# EAGLE design ppg_array_wireless (EAGLE 9.1.1)
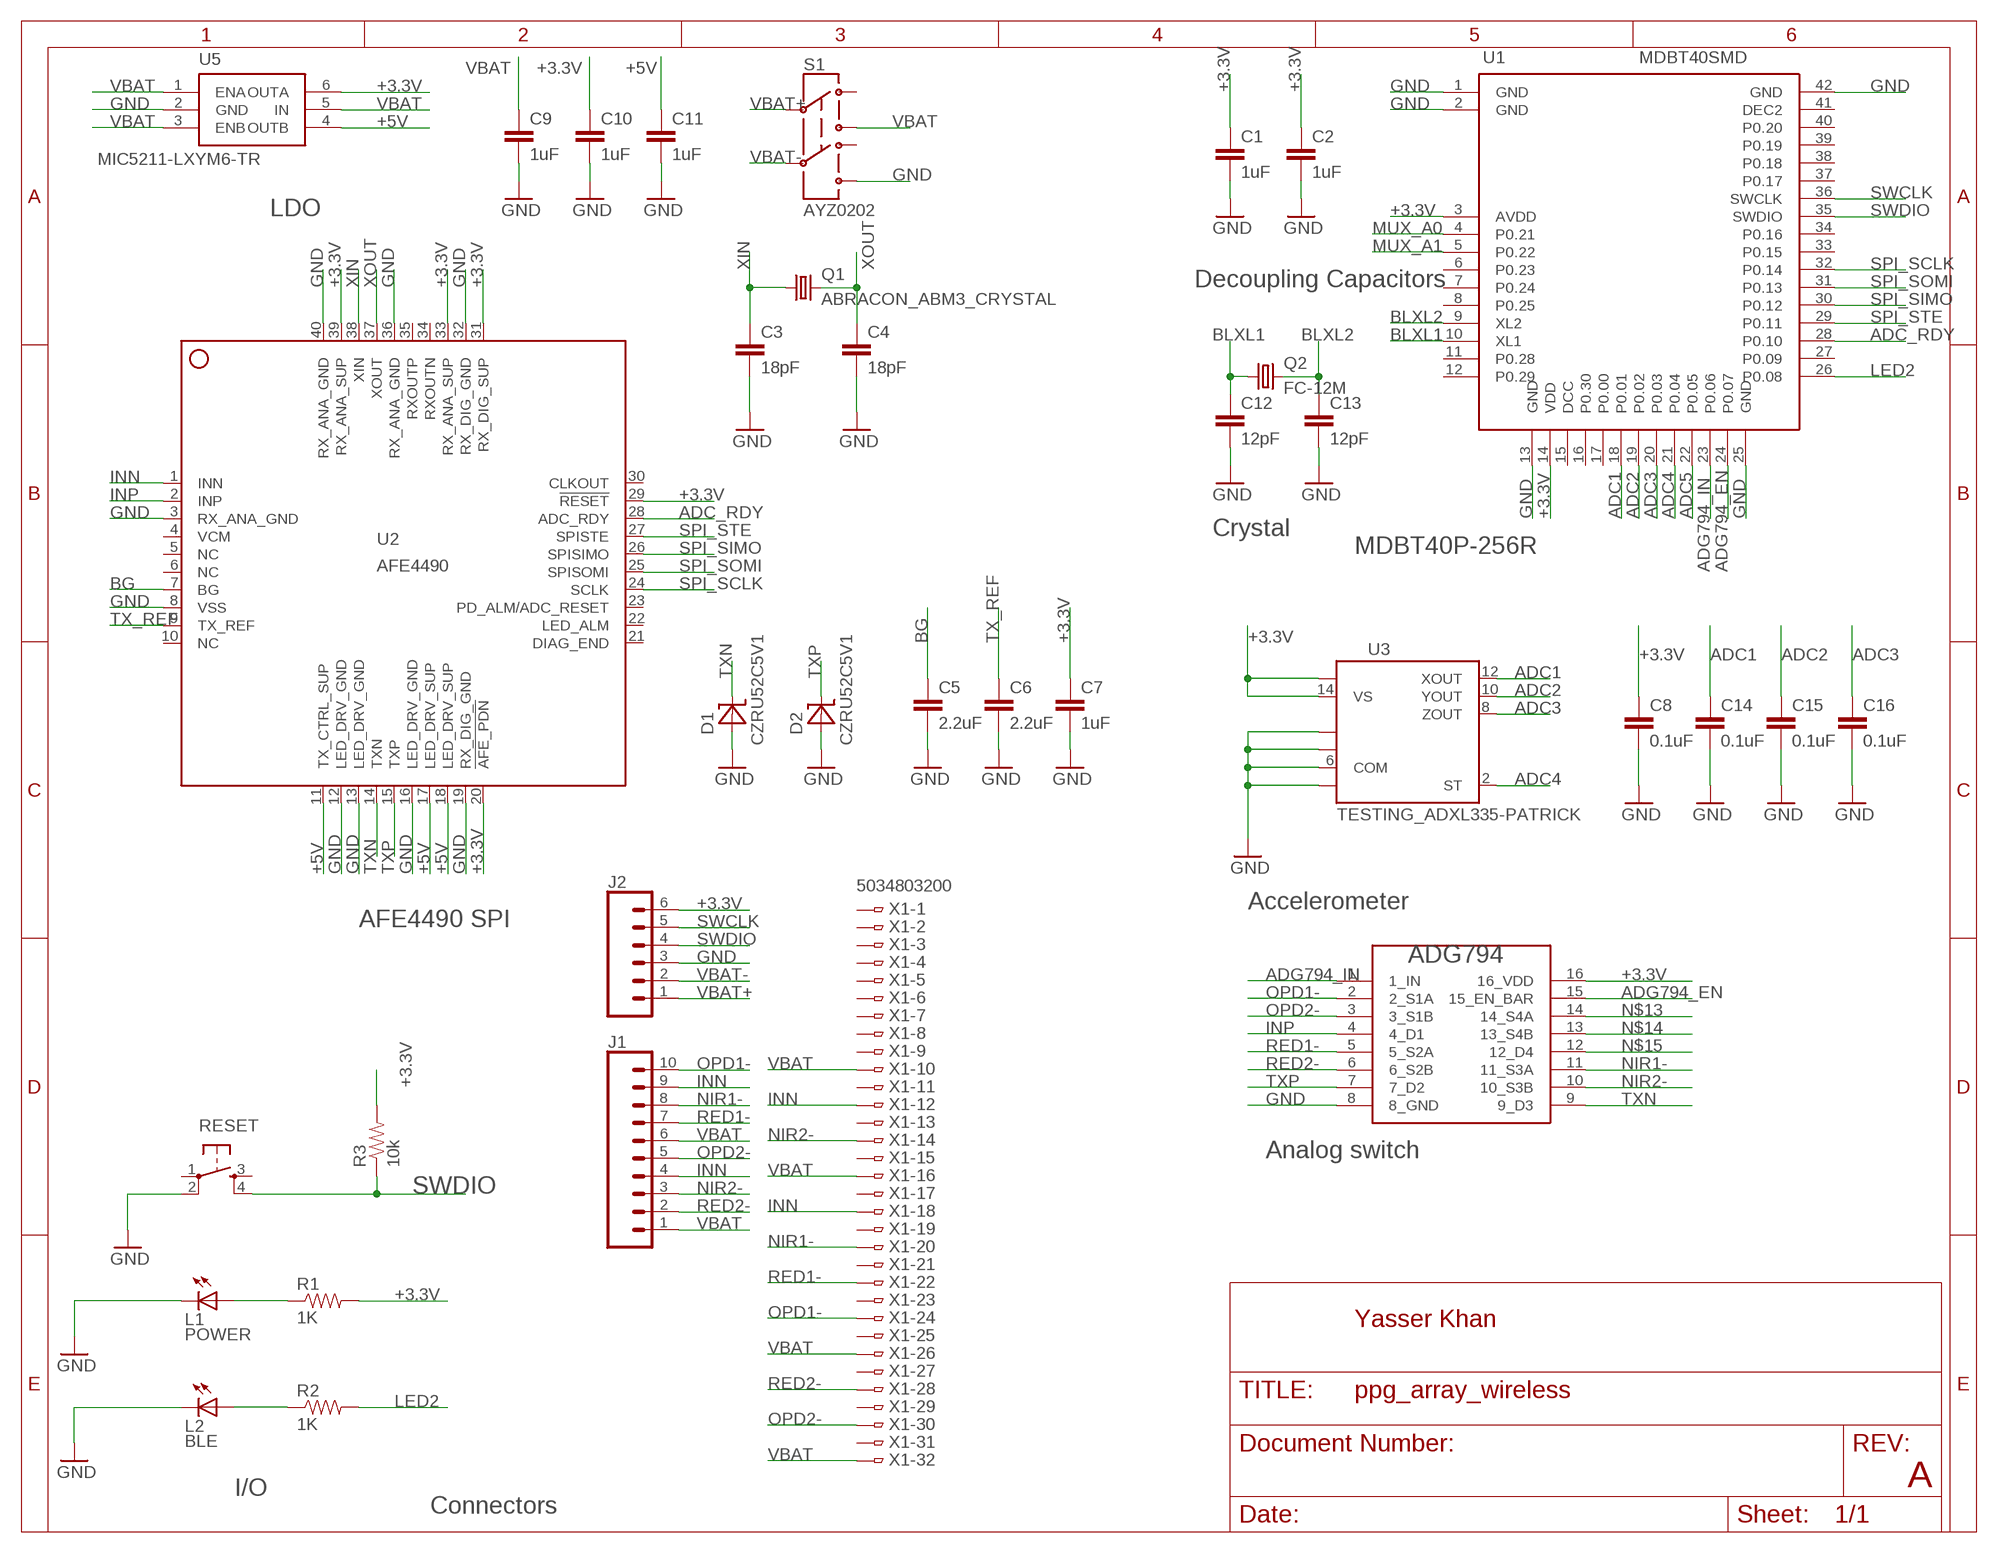
[diagram p0: schematic, sheet 1]

## Parts
C1  1uF  CAP0603-CAP  [0603-CAP]
C2  1uF  CAP0603-CAP  [0603-CAP]
C3  18pF  CAP0603-CAP  [0603-CAP]
C4  18pF  CAP0603-CAP  [0603-CAP]
C5  2.2uF  CAP0603-CAP  [0603-CAP]
C6  2.2uF  CAP0603-CAP  [0603-CAP]
C7  1uF  CAP0603-CAP  [0603-CAP]
C8  0.1uF  CAP0603-CAP  [0603-CAP]
C9  1uF  CAP0603-CAP  [0603-CAP]
C10  1uF  CAP0603-CAP  [0603-CAP]
C11  1uF  CAP0603-CAP  [0603-CAP]
C12  12pF  CAP0603-CAP  [0603-CAP]
C13  12pF  CAP0603-CAP  [0603-CAP]
C14  0.1uF  CAP0603-CAP  [0603-CAP]
C15  0.1uF  CAP0603-CAP  [0603-CAP]
C16  0.1uF  CAP0603-CAP  [0603-CAP]
D1  CZRU52C5V1  [CZRU52C5V1]
D2  CZRU52C5V1  [CZRU52C5V1]
J1  CONN_10"  [1X10]
J2  CONN_06SILK_FEMALE_PTH  [1X06]
L1  POWER  LEDCHIP-LED0603  [CHIP-LED0603]
L2  BLE  LEDCHIP-LED0603  [CHIP-LED0603]
Q1  ABRACON_ABM3_CRYSTAL  [ABRACON_ABM3_CRYSTAL]
Q2  FC-12M  [FC-12M]
R1  1K  RESISTOR0603-RES  [0603-RES]
R2  1K  RESISTOR0603-RES  [0603-RES]
R3  10k  RESISTOR0603-RES  [0603-RES]
RESET  TAC_SWITCHSMD  [TACTILE_SWITCH_SMD]
S1  AYZ0202  [AYZ0202]
U1  MDBT40SMD  [MDBT40]
U2  AFE4490  [QFN40-6X6]
U3  TESTING_ADXL335-PATRICK  [TESTING_LFCSP-16]
U4  ADG794  [QSOP16]
U5  MIC5211-LXYM6-TR  [SOT-23-6]
X1  5034803200  [5034803200]

## Nets
+3.3V: C1.1 C2.1 C7.1 C8.1 C10.1 J2.6 R1.2 R3.2 U1.3(AVDD) U1.14(VDD) U2.20(!AFE_PDN) U2.29(!RESET) U2.31(RX_DIG_SUP) U2.33(RX_ANA_SUP) U2.39(RX_ANA_SUP) U3.14(VS) U3.15(VS) U4.16(16_VDD) U5.6(OUTA)
+5V: C11.1 U2.11(TX_CTRL_SUP) U2.17(LED_DRV_SUP) U2.18(LED_DRV_SUP) U5.4(OUTB)
ADC1: C14.1 U1.18(P0.01) U3.12(XOUT)
ADC2: C15.1 U1.19(P0.02) U3.10(YOUT)
ADC3: C16.1 U1.20(P0.03) U3.8(ZOUT)
ADC4: U1.21(P0.04) U3.2(ST)
ADC5: U1.22(P0.05)
ADC_RDY: U1.28(P0.10) U2.28(ADC_RDY)
ADG794_EN: U1.24(P0.07) U4.15(15_EN_BAR)
ADG794_IN: U1.23(P0.06) U4.1(1_IN)
BG: C5.1 U2.7(BG)
BLXL1: C12.1 Q2.1 U1.10(XL1)
BLXL2: C13.1 Q2.2 U1.9(XL2)
GND: C1.2 C2.2 C3.2 C4.2 C5.2 C6.2 C7.2 C8.2 C9.2 C10.2 C11.2 C12.2 C13.2 C14.2 C15.2 C16.2 D1.A D2.A J2.3 L1.C L2.C RESET.2 S1.4 U1.1(GND) U1.2(GND) U1.13(GND) U1.25(GND) U1.42(GND) U2.3(RX_ANA_GND) U2.8(VSS) U2.12(LED_DRV_GND) U2.13(LED_DRV_GND) U2.16(LED_DRV_GND) U2.19(RX_DIG_GND) U2.32(RX_DIG_GND) U2.36(RX_ANA_GND) U2.40(RX_ANA_GND) U3.3(COM) U3.5(COM) U3.6(COM) U3.7(COM) U4.8(8_GND) U5.2(GND)
INN: J1.4 J1.9 U2.1(INN) X1.12 X1.18
INP: U2.2(INP) U4.4(4_D1)
LED2: R2.2 U1.26(P0.08)
MUX_A0: U1.4(P0.21)
MUX_A1: U1.5(P0.22)
N$1: L1.A R1.1
N$4: L2.A R2.1
N$13: U4.14(14_S4A)
N$14: U4.13(13_S4B)
N$15: U4.12(12_D4)
NIR1-: J1.8 U4.11(11_S3A) X1.20
NIR2-: J1.3 U4.10(10_S3B) X1.14
OPD1-: J1.10 U4.2(2_S1A) X1.24
OPD2-: J1.5 U4.3(3_S1B) X1.30
RED1-: J1.7 U4.5(5_S2A) X1.22
RED2-: J1.2 U4.6(6_S2B) X1.28
SPI_SCLK: U1.32(P0.14) U2.24(SCLK)
SPI_SIMO: U1.30(P0.12) U2.26(SPISIMO)
SPI_SOMI: U1.31(P0.13) U2.25(SPISOMI)
SPI_STE: U1.29(P0.11) U2.27(SPISTE)
SWCLK: J2.5 U1.36(SWCLK)
SWDIO: J2.4 R3.1 RESET.4 U1.35(SWDIO)
TX_REF: C6.1 U2.9(TX_REF)
TXN: D1.C U2.14(TXN) U4.9(9_D3)
TXP: D2.C U2.15(TXP) U4.7(7_D2)
VBAT: C9.1 J1.1 J1.6 S1.1 U5.1(ENA) U5.3(ENB) U5.5(IN) X1.10 X1.16 X1.26 X1.32
VBAT+: J2.1 S1.2
VBAT-: J2.2 S1.5
XIN: C3.1 Q1.P$1 U2.38(XIN)
XOUT: C4.1 Q1.P$2 U2.37(XOUT)
Unconnected: RESET.1 RESET.3 S1.3 S1.6 U1.6(P0.23) U1.7(P0.24) U1.8(P0.25) U1.11(P0.28) U1.12(P0.29) U1.15(DCC) U1.16(P0.30) U1.17(P0.00) U1.27(P0.09) U1.33(P0.15) U1.34(P0.16) U1.37(P0.17) U1.38(P0.18) U1.39(P0.19) U1.40(P0.20) U1.41(DEC2) U2.4(VCM) U2.5(NC) U2.6(NC) U2.10(NC) U2.21(DIAG_END) U2.22(LED_ALM) U2.23(PD_ALM/ADC_RESET) U2.30(CLKOUT) U2.34(RXOUTN) U2.35(RXOUTP) X1.1 X1.2 X1.3 X1.4 X1.5 X1.6 X1.7 X1.8 X1.9 X1.11 X1.13 X1.15 X1.17 X1.19 X1.21 X1.23 X1.25 X1.27 X1.29 X1.31

## Notes on the sheet
- LDO
- Decoupling Capacitors
- Crystal
- MDBT40P-256R
- Accelerometer
- AFE4490 SPI
- Analog switch
- Yasser Khan
- A
- I/O
- Connectors

## Power pins joined to a net without a drawn wire
GND: U2.EXP@1(GND) U2.EXP@2(GND) U2.EXP@3(GND) U2.EXP@4(GND) U2.EXP@5(GND) U2.EXP@6(GND) U2.EXP@7(GND) U2.EXP@8(GND) U2.EXP@9(GND) U2.EXP@10(GND) U2.EXP@11(GND) U2.EXP@12(GND) U2.EXP@13(GND) U2.EXP@14(GND) U2.EXP@15(GND) U2.EXP@16(GND) U2.PWR@1(GND) U2.PWR@2(GND)

## Library data of the parts
C1-C16 = SparkFun-Capacitors:CAP: Capacitor Standard 0603 ceramic capacitor, and 0.1" leaded capacitor.
D1 D2 = diode:CZRU52C5V1
J1 = SparkFun-Connectors:CONN_10: Multi connection point. Often used as Generic Header-pin footprint for 0.1 inch spaced/style header connections On any of the 0.1 inch spaced packages, you can populate with these: Break Away Headers - Straight <https://www.sparkfun.com/products/116> (PRT-00116) Break Away Male Headers - Right Angle <https://www.sparkfun.com/products/553> (PRT-00553) Female Headers <https://www.sparkfun.com/products/115> (PRT-00115) Break Away Headers - Machine Pin <https://www.sparkfun.com/products/117> (PRT-00117) Break Away Female Headers - Swiss Machine Pin <https://www.sparkfun.com/products/743> (PRT-00743) Arduino Stackable Header - 10 Pin <https://www.sparkfun.com/products/11376> (PRT-11376) For SCREWTERMINALS and SPRING TERMINALS visit here: Screw Terimnals on SparkFun.com <https://www.sparkfun.com/search/results?term=Screw+Terminals> (5mm/3.5mm/2.54mm spacing) This device is also useful as a general connection point to wire up your design to another part of your project. Our various solder wires solder well into these plated through hole pads. Hook-Up Wire - Assortment (Stranded, 22 AWG) <https://www.sparkfun.com/products/11375> (PRT-11375) Hook-Up Wire - Assortment (Solid Core, 22 AWG) <https://www.sparkfun.com/products/11367> (PRT-11367) View the entire wire category on our website here <https://www.sparkfun.com/categories/141> Special notes: Molex polarized connector foot print use with SKU : PRT-08231 with associated crimp pins and housings. 1MM SMD Version SKU: PRT-10208 NOTES ON THE VARIANTS LOCK and LOCK_LONGPADS... This footprint was designed to help hold the alignment of a through-hole component (i.e. 6-pin header) while soldering it into place. You may notice that each hole has been shifted either up or down by 0.005 of an inch from it's more standard position (which is a perfectly straight line). This slight alteration caused the pins (the squares in the middle) to touch the edges of the holes. Because they are alternating, it causes a "brace" to hold the component in place. 0.005 has proven to be the perfect amount of "off-center" position when using our standard breakaway headers. Although looks a little odd when you look at the bare footprint, once you have a header in there, the alteration is very hard to notice. Also,if you push a header all the way into place, it is covered up entirely on the bottom side.; PROD_ID: CONN-11563
J2 = SparkFun-Connectors:CONN_06: Multi connection point. Often used as Generic Header-pin footprint for 0.1 inch spaced/style header connections On any of the 0.1 inch spaced packages, you can populate with these: Break Away Headers - Straight <https://www.sparkfun.com/products/116> (PRT-00116) Break Away Male Headers - Right Angle <https://www.sparkfun.com/products/553> (PRT-00553) Female Headers <https://www.sparkfun.com/products/115> (PRT-00115) Break Away Headers - Machine Pin <https://www.sparkfun.com/products/117> (PRT-00117) Break Away Female Headers - Swiss Machine Pin <https://www.sparkfun.com/products/743> (PRT-00743) Arduino Stackable Header - 6 Pin <https://www.sparkfun.com/products/9280> (PRT-09280) For SCREWTERMINALS and SPRING TERMINALS visit here: Screw Terimnals on SparkFun.com <https://www.sparkfun.com/search/results?term=Screw+Terminals> (5mm/3.5mm/2.54mm spacing) This device is also useful as a general connection point to wire up your design to another part of your project. Our various solder wires solder well into these plated through hole pads. Hook-Up Wire - Assortment (Stranded, 22 AWG) <https://www.sparkfun.com/products/11375> (PRT-11375) Hook-Up Wire - Assortment (Solid Core, 22 AWG) <https://www.sparkfun.com/products/11367> (PRT-11367) View the entire wire category on our website here <https://www.sparkfun.com/categories/141>; PROD_ID: CONN-08437
L1 L2 = led:LED: LED OSRAM: - CHIPLED LG R971, LG N971, LY N971, LG Q971, LY Q971, LO R971, LY R971 LH N974, LH R974 LS Q976, LO Q976, LY Q976 LO Q996 - Hyper CHIPLED LW Q18S LB Q993, LB Q99A, LB R99A - SideLED LS A670, LO A670, LY A670, LG A670, LP A670 LB A673, LV A673, LT A673, LW A673 LH A674 LY A675 LS A676, LA A676, LO A676, LY A676, LW A676 LS A679, LY A679, LG A679 - Hyper Micro SIDELED® LS Y876, LA Y876, LO Y876, LY Y876 LT Y87S - SmartLED LW L88C, LW L88S LB L89C, LB L89S, LG L890 LS L89K, LO L89K, LY L89K LS L896, LA L896, LO L896, LY L896 - TOPLED LS T670, LO T670, LY T670, LG T670, LP T670 LSG T670, LSP T670, LSY T670, LOP T670, LYG T670 LG T671, LOG T671, LSG T671 LB T673, LV T673, LT T673, LW T673 LH T674 LS T676, LA T676, LO T676, LY T676, LB T676, LH T676, LSB T676, LW T676 LB T67C, LV T67C, LT T67C, LS T67K, LO T67K, LY T67K, LW E67C LS E67B, LA E67B, LO E67B, LY E67B, LB E67C, LV E67C, LT E67C LW T67C LS T679, LY T679, LG T679 LS T770, LO T770, LY T770, LG T770, LP T770 LB T773, LV T773, LT T773, LW T773 LH T774 LS E675, LA E675, LY E675, LS T675 LS T776, LA T776, LO T776, LY T776, LB T776 LHGB T686 LT T68C, LB T68C - Hyper Mini TOPLED® LB M676 - Mini TOPLED Santana® LG M470 LS M47K, LO M47K, LY M47K Source: http://www.osram.convergy.de LUXEON: - LUMILED® LXK2-PW12-R00, LXK2-PW12-S00, LXK2-PW14-U00, LXK2-PW14-V00 LXK2-PM12-R00, LXK2-PM12-S00, LXK2-PM14-U00 LXK2-PE12-Q00, LXK2-PE12-R00, LXK2-PE12-S00, LXK2-PE14-T00, LXK2-PE14-U00 LXK2-PB12-K00, LXK2-PB12-L00, LXK2-PB12-M00, LXK2-PB14-N00, LXK2-PB14-P00, LXK2-PB14-Q00 LXK2-PR12-L00, LXK2-PR12-M00, LXK2-PR14-Q00, LXK2-PR14-R00 LXK2-PD12-Q00, LXK2-PD12-R00, LXK2-PD12-S00 LXK2-PH12-R00, LXK2-PH12-S00 LXK2-PL12-P00, LXK2-PL12-Q00, LXK2-PL12-R00 Source: www.luxeon.com KINGBRIGHT: KA-3528ASYC Source: www.kingbright.com
Q1 = Ava:ABRACON_ABM3_CRYSTAL
Q2 = crystal:FC-12M: kHz RANGE CRYSTAL UNIT LOW PROFILE SMD Source: Epson Toyocom FC-12M.pdf
R1-R3 = SparkFun-Passives:RESISTOR: Resistor Basic schematic elements and footprints for 0603, 1206, and PTH resistors.
RESET = Spark:TAC_SWITCH: SMD Tactiile Switch
S1 = SparkFun-Electromechanical:AYZ0202: SPDT Slide Switch Simple SMD single-pull double-throw slide switch. Good for less than 350mA power switch, switching UARTs between devices, etc. Spark Fun Electronics SKU : COM-00597; PROD_ID: SWCH-08179
U1 = MDBT40P:MDBT40
U2 = AFE4490:AFE4490
U3 = ADXL335_Breakout:TESTING_ADXL335-PATRICK
U4 = ADG794:ADG794
U5 = smd-footprints:MIC5211-LXYM6-TR
X1 = con-hirose:5034803200: 0.5mm Pitch Connectors For FPC/FFC Source: Data sheet <http://www.hirose.co.jp/cataloge_hp/e58605370.pdf>

## Board
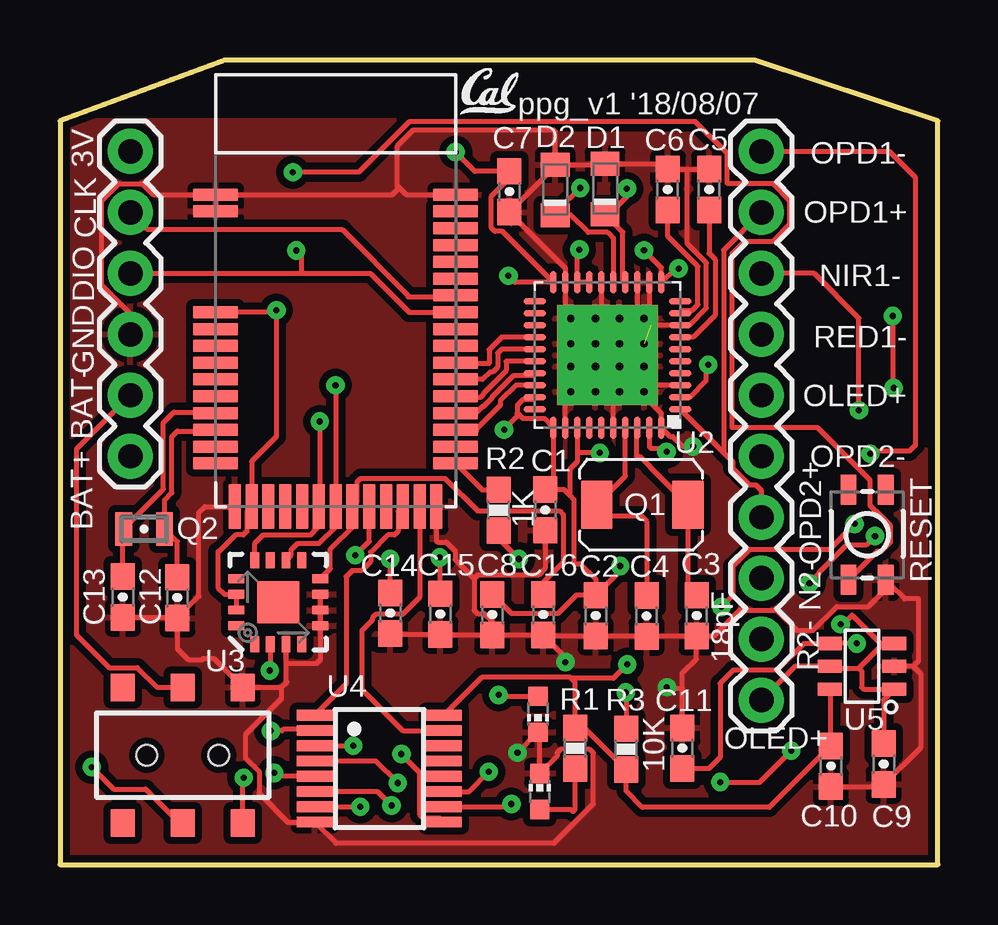
[diagram p1: board, top side]
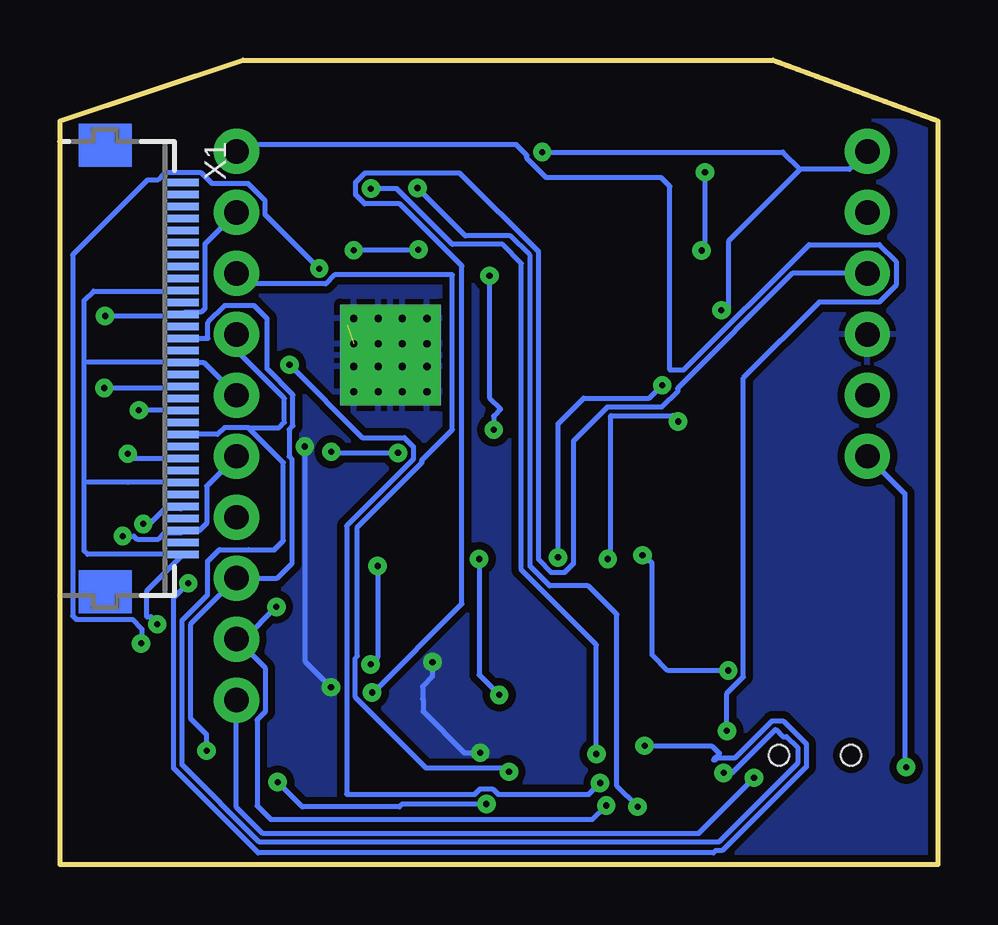
[diagram p2: board, bottom side, seen from below]

Size 36.58 x 33.53 mm. Coordinates in mm from the lower left corner, seen from the top.
Outline: 0,0 36.58,0 36.58,30.99 28.96,33.53 6.86,33.53 0,30.99 0,0
Copper layers (1*16): Top 0.035mm / dielectric 1.5mm / Bottom 0.035mm
Design rules "2016_09_11_SparkFun_bayareacircuits *": minimum track width 8mil, minimum drill 10mil, track to track 6mil, track to pad 6mil, pad to pad 6mil, via to via 6mil, smd to smd 6mil, copper to edge 10mil, drill to drill 8mil, minimum pad ring 12mil, minimum via ring 10mil, stop-mask expansion 4mil, vias tented up to drill 25mil, thermal gap 10mil

### Footprints (pad centres in the part's own frame; a part is rotated, then mirrored left to right if it is on the bottom)
0603-CAP = smd 1.1 x 1: 1 -0.85,0; 2 0.85,0
CZRU52C5V1 = smd 1 x 1.2: A 1.05,0; C -1.05,0
1X10 = drill 1.016 pad 1.88: 1 0,0; 2 2.54,0; 3 5.08,0; 4 7.62,0; 5 10.16,0; 6 12.7,0; 7 15.24,0; 8 17.78,0; 9 20.32,0; 10 22.86,0
1X06 = drill 1.016 pad 1.88: 1 0,0; 2 2.54,0; 3 5.08,0; 4 7.62,0; 5 10.16,0; 6 12.7,0
CHIP-LED0603 = smd 0.8 x 0.8: A 0,-0.75; C 0,0.75
ABRACON_ABM3_CRYSTAL = smd 1.3 x 2: P$1 -3.4,0.1; P$2 0.4,0.1
FC-12M = smd 0.7 x 1.4: 1 -0.85,0; 2 0.85,0
0603-RES = smd 1.1 x 1: 1 -0.85,0; 2 0.85,0
TACTILE_SWITCH_SMD = smd 1.25 x 0.65: 1 -1.875,0.775; 2 1.875,0.775; 3 -1.875,-0.775; 4 1.875,-0.775
AYZ0202 = smd 1 x 1.15: 1 -2.5,2.825; 2 0,2.825; 3 2.5,2.825; 4 -2.5,-2.825; 5 0,-2.825; 6 2.5,-2.825 | hole 0.85: 1.5,0; -1.5,0
MDBT40 = smd 1.85 x 0.5: 1 -5,4; 2 -5,3.3; 3 -5,-0.9; 4 -5,-1.6; 5 -5,-2.3; 6 -5,-3; 7 -5,-3.7; 8 -5,-4.4; 9 -5,-5.1; 10 -5,-5.8; 11 -5,-6.5; 12 -5,-7.2; 26 5,-7.2; 27 5,-6.5; 28 5,-5.8; 29 5,-5.1; 30 5,-4.4; 31 5,-3.7; 32 5,-3; 33 5,-2.3; 34 5,-1.6; 35 5,-0.9; 36 5,-0.2; 37 5,0.5; 38 5,1.2; 39 5,1.9; 40 5,2.6; 41 5,3.3; 42 5,4 | smd 0.5 x 1.85: 13 -4.2,-9; 14 -3.5,-9; 15 -2.8,-9; 16 -2.1,-9; 17 -1.4,-9; 18 -0.7,-9; 19 0,-9; 20 0.7,-9; 21 1.4,-9; 22 2.1,-9; 23 2.8,-9; 24 3.5,-9; 25 4.2,-9
QFN40-6X6 = smd 0.95 x 0.28: 1 -3.025,2.25; 2 -3.025,1.75; 3 -3.025,1.25; 4 -3.025,0.75; 5 -3.025,0.25; 6 -3.025,-0.25; 7 -3.025,-0.75; 8 -3.025,-1.25; 9 -3.025,-1.75; 10 -3.025,-2.25; 21 3.025,-2.25; 22 3.025,-1.75; 23 3.025,-1.25; 24 3.025,-0.75; 25 3.025,-0.25; 26 3.025,0.25; 27 3.025,0.75; 28 3.025,1.25; 29 3.025,1.75; 30 3.025,2.25 | smd 0.28 x 0.95: 11 -2.25,-3.025; 12 -1.75,-3.025; 13 -1.25,-3.025; 14 -0.75,-3.025; 15 -0.25,-3.025; 16 0.25,-3.025; 17 0.75,-3.025; 18 1.25,-3.025; 19 1.75,-3.025; 20 2.25,-3.025; 31 2.25,3.025; 32 1.75,3.025; 33 1.25,3.025; 34 0.75,3.025; 35 0.25,3.025; 36 -0.25,3.025; 37 -0.75,3.025; 38 -1.25,3.025; 39 -1.75,3.025; 40 -2.25,3.025 | drill 0.3 pad 1.1 square: EXP@1 -1.525,1.525; EXP@2 -0.5,1.525; EXP@3 0.5,1.525; EXP@4 1.525,1.525; EXP@5 -1.525,0.475; EXP@6 -0.5,0.475; EXP@7 0.5,0.475; EXP@8 1.525,0.475; EXP@9 -1.525,-0.475; EXP@10 -0.5,-0.475; EXP@11 0.5,-0.475; EXP@12 1.525,-0.475; EXP@13 -1.525,-1.525; EXP@14 -0.5,-1.525; EXP@15 0.5,-1.525; EXP@16 1.525,-1.525 | smd 4.191 x 4.191 bottom: PWR@1 0,0 | smd 4.191 x 4.191: PWR@2 0,0
TESTING_LFCSP-16 = smd 1.75 x 1.75: 0 0,0 | smd 0.65 x 0.37: 1 -1.75,0.975; 2 -1.75,0.325; 3 -1.75,-0.325; 4 -1.75,-0.975; 9 1.75,-0.975; 10 1.75,-0.325; 11 1.75,0.325; 12 1.75,0.975 | smd 0.37 x 0.65: 5 -0.975,-1.75; 6 -0.325,-1.75; 7 0.325,-1.75; 8 0.975,-1.75; 13 0.975,1.75; 14 0.325,1.75; 15 -0.325,1.75; 16 -0.975,1.75
QSOP16 = smd 0.45 x 1.5: 1 -2.223,-2.69; 2 -1.587,-2.69; 3 -0.953,-2.69; 4 -0.318,-2.69; 5 0.318,-2.69; 6 0.953,-2.69; 7 1.587,-2.69; 8 2.223,-2.69; 9 2.223,2.69; 10 1.587,2.69; 11 0.953,2.69; 12 0.318,2.69; 13 -0.318,2.69; 14 -0.953,2.69; 15 -1.587,2.69; 16 -2.223,2.69
SOT-23-6 = smd 1 x 0.55: 1 -1.35,0.95; 2 -1.35,0; 3 -1.35,-0.95; 4 1.35,-0.95; 5 1.35,0; 6 1.35,0.95
5034803200 = smd 0.3 x 1.3: 1 -7.75,3.25; 2 -7.25,3.25; 3 -6.75,3.25; 4 -6.25,3.25; 5 -5.75,3.25; 6 -5.25,3.25; 7 -4.75,3.25; 8 -4.25,3.25; 9 -3.75,3.25; 10 -3.25,3.25; 11 -2.75,3.25; 12 -2.25,3.25; 13 -1.75,3.25; 14 -1.25,3.25; 15 -0.75,3.25; 16 -0.25,3.25; 17 0.25,3.25; 18 0.75,3.25; 19 1.25,3.25; 20 1.75,3.25; 21 2.25,3.25; 22 2.75,3.25; 23 3.25,3.25; 24 3.75,3.25; 25 4.25,3.25; 26 4.75,3.25; 27 5.25,3.25; 28 5.75,3.25; 29 6.25,3.25; 30 6.75,3.25; 31 7.25,3.25; 32 7.75,3.25

### Placement (x,y rotation side)
C1  20.22,14.78 270 top
C2  22.32,10.38 270 top
C3  26.52,10.38 270 top
C4  24.44,10.36 270 top
C5  27.05,28.13 90 top
C6  25.33,28.13 90 top
C7  18.73,28.04 270 top
C8  18.01,10.41 270 top
C9  34.32,4.19 270 top
C10  32.12,4.1 270 top
C11  25.93,4.85 90 top
C12  4.89,11.13 270 top
C13  2.62,11.15 270 top
C14  13.77,10.48 270 top
C15  15.85,10.44 270 top
C16  20.14,10.41 270 top
D1  22.71,28.15 90 top
D2  20.64,28.11 90 top
J1  29.22,6.86 90 top
J2  2.93,17.02 90 top
L1  19.99,3.05 0 top
L2  19.91,6.27 180 top
Q1  22.77,15.09 180 top
Q2  3.51,13.99 180 top
R1  21.47,4.85 90 top
R2  18.28,14.77 90 top
R3  23.58,4.81 270 top
RESET  33.63,13.74 270 top
S1  5.12,4.56 180 top
U1  11.49,23.92 0 top
U2  22.81,21.24 180 top
U3  9.09,10.93 90 top
U4  13.31,4 270 top
U5  33.42,8.26 180 top
U$1  [CAL]  16.64,31.23 0 top
X1  34.7,20.68 270 bottom

### Tracks (layer width: path | path; a pad name or v marks a point on that pad's centre or on a via)
+3.3V  (via drill 0.25, 0.25 pad 0.25)
  Top 0.203: 19.06,18.82 19.06,19.15 19.29,19.38 19.68,19.38 U2.29 | 19.06,18.82 19.29,18.59 20.18,18.59 U2.31 20.56,15.94 20.26,15.63 | U1.3 8.93,23.02 v9.02,23.1 9.02,17.83 7.99,16.8 U1.14 7.79,14.72 7.79,13.89 7.64,13.74 7.31,13.74 6.62,13.04 6.58,13.04 6.58,11.54 6.86,11.26 U3.14 U3.15 | C2.1 22.32,11.9 21.68,12.55 21.41,12.55 21.41,15.21 21.23,15.39 | C1.1 20.26,15.63 | 20.26,15.63 20.99,15.63 21.23,15.39 | U2.33 21.56,17.2 | 21.56,17.2 21.56,16.8 21.23,16.47 21.23,15.39 | U5.6 32.12,7.26 C10.1 29.56,2.39 24.27,2.39 23.58,3.07 R3.2 21.85,5.7 R1.2 21.47,7.6 21.3,7.77 | 21.3,7.77 21.27,7.8 17.58,7.8 U4.16 | v16.48,29.69 17.29,28.89 C7.1 18.73,28.6 17.97,27.85 17.97,26.54 18.12,26.39 18.43,26.39 U2.20 18.96,24.26 v18.68,24.54 | C2.1 21.51,11.23 20.75,10.46 20.02,10.46 18.81,10.46 C8.1 | U2.39 24.56,17.41 24.62,17.35 25.13,17.35 v25.27,17.2 | v22.49,17.16 21.6,17.16 21.56,17.2 | v18.5,18.12 19.06,18.68 19.06,18.82 | C2.1 23.34,12.25 v23.34,12.45 | v23.64,8.34 23.06,7.77 21.3,7.77
  Bottom 0.203: J2.6 3.68,28.97 5.73,28.97 | 5.73,28.97 8.73,25.97 8.73,23.04 8.95,23.04 v9.02,23.1 | v16.48,29.69 6.45,29.69 5.73,28.97 | v25.27,17.2 25.23,17.16 v22.49,17.16 | v18.68,24.54 18.68,19.46 18.21,18.99 18.5,18.69 v18.5,18.12 | v23.34,12.45 23.34,8.64 v23.64,8.34
+5V  (via drill 0.25 pad 0.25)
  Top 0.203: v24.33,25.6 25.06,24.88 U2.11 25.64,24.84 v25.78,24.84 | U2.17 U2.18 21.56,25.55 v21.64,25.63 | C11.1 27.04,4 27.51,4.47 27.51,7.56 28.05,8.1 29.87,8.1 30.98,9.21 U5.4 v33.2,9.22
  Bottom 0.203: v21.64,25.63 21.67,25.6 v24.33,25.6 | v25.78,24.84 28.03,27.09 28.03,27.67 28.73,28.37 30.23,28.37 30.69,28.83 32.2,28.83 32.51,28.52 32.93,28.52 36.05,25.41 36.05,10.37 35.9,10.22 33.56,10.22 33.16,9.82 33.16,9.26 v33.2,9.22
ADC1  (via drill 0.25 pad 0.25)
  Top 0.203: U3.12 8.12,13.39 8.47,13.74 10.44,13.74 10.59,13.89 10.59,13.92 10.82,14.15 10.82,14.88 U1.18 10.8,14.93 10.8,15.44 10.82,15.47 v10.82,18.47 | C14.1 13.77,12.72 v13.75,12.74
  Bottom 0.203: v13.75,12.74 13.63,12.87 13.63,18.71 11.06,18.71 v10.82,18.47
ADC2  (via drill 0.25 pad 0.25)
  Top 0.203: U3.10 9.63,12.9 9.63,13.12 9.9,13.38 10.79,13.38 11.49,14.08 U1.19 v11.48,19.98 | C15.1 15.85,12.78 v15.82,12.8
  Bottom 0.203: v15.82,12.8 15.82,18.38 14.76,19.44 12.01,19.44 v11.48,19.98
ADC3
  Top 0.203: U3.8 11.27,12.33 11.27,13.16 12.23,14.12 12.23,14.87 U1.20 12.38,15.11 12.38,15.95 12.53,16.1 16.04,16.1 17.4,14.74 20.82,14.74 20.97,14.59 20.97,12.59 20.14,11.77 C16.1
ADC4  (via drill 0.25 pad 0.25)
  Top 0.203: U3.2 8.77,8.12 v8.73,8.09 | v12.31,12.89 12.89,13.47 U1.21
  Bottom 0.203: v8.73,8.09 11.25,8.09 11.9,8.74 11.9,12.56 12.22,12.88 12.32,12.88 v12.31,12.89
ADC_RDY
  Top 0.203: U2.28 19,19.99 18.35,19.34 18.35,19.15 17.35,18.15 17.35,18.05 16.56,18.05 U1.28
ADG794_EN
  Top 0.203: U1.24 14.99,11.14 14.28,10.43 13.16,10.43 13.01,10.28 13.01,10.19 12.57,9.75 12.57,7.3 14.29,5.59 U4.15
ADG794_IN
  Top 0.203: U1.23 14.09,14.72 14.09,13.89 13.94,13.74 13.66,13.74 12.94,13.02 12.94,12.63 12.57,12.26 12.17,12.26 11.93,12.01 11.93,7.53 U4.1
BG
  Top 0.203: C5.1 27.05,25.47 27.29,25.23 27.29,22.9 26.38,21.99 U2.7
BLXL1
  Top 0.203: U1.10 6.43,18.06 4.89,18.06 4.66,17.83 4.66,15.5 4.36,15.19 Q2.1 4.89,13.46 C12.1
BLXL2
  Top 0.203: U1.9 6.44,18.86 4.75,18.86 4.3,18.41 4.3,15.64 Q2.2 2.62,13.95 C13.1
GND  (via drill 0.25 pad 0.25)  (1 unrouted)
  Top 0.203: U2.32 21.06,19.49 U2.EXP@4 U2.PWR@2 | D2.A 22.67,29.16 D1.A 25.11,29.2 C6.2 26.14,28.98 | 26.14,28.98 C5.2 | D2.A 20.64,29.1 C7.2 21.06,24.86 U2.19 21.06,22.99 U2.EXP@16 | J2.3 2.93,22.95 1.74,24.14 1.74,27.67 2.44,28.37 3.43,28.37 3.88,27.92 U1.1 | U1.1 U1.2 | C13.2 4.87,10.3 C12.2 | C12.2 5.79,11.17 5.79,14.68 6.03,14.92 U1.13 | C12.2 4.89,8.99 5.33,8.55 5.93,8.55 5.98,8.6 6.4,8.6 S1.4 9.23,7.38 | 9.23,7.38 9.45,7.61 9.42,7.64 9.42,8.38 | 9.42,8.38 U3.3 | U3.7 U3.5 | U3.6 U3.5 | U3.5 10.84,8.54 10.68,8.38 9.42,8.38 | C3.2 26.51,9.51 | 26.51,9.51 C4.2 22.34,9.51 C2.2 20.18,9.53 | 20.18,9.53 C16.2 C8.2 | C8.2 15.88,9.56 C15.2 13.8,9.59 C14.2 | C10.2 34.23,3.25 C9.2 35.88,4.9 35.88,7.94 35.55,8.26 | 35.55,8.26 U5.2 | 35.55,8.26 35.78,8.49 35.78,11.07 35.2,11.07 34.6,11.67 | 34.6,11.67 RESET.2 | U2.12 24.56,22.99 U2.EXP@13 | U2.13 24.06,23.04 U2.EXP@13 | 24.49,22.6 24.61,22.49 U2.8 26.23,22.49 26.94,23.19 26.94,25.08 26.14,25.88 26.14,28.98 | 24.49,22.6 24.35,22.75 | 24.35,22.75 U2.EXP@13 | U2.3 24.61,19.99 24.45,19.83 | 24.45,19.83 U2.EXP@1 U2.PWR@2 | 24.45,19.83 24.45,19.41 25.06,18.81 U2.40 25.43,17.84 25.54,17.84 25.95,17.42 v26.38,17.42 | U2.36 23.06,19.46 U2.EXP@2 23.31,20.74 U2.PWR@2 | C11.2 25.93,7.35 | 25.93,7.35 25.93,7.99 26.51,8.57 26.51,9.51 | 26.51,9.51 27.23,9.51 28.32,10.6 29.87,10.6 30.7,9.78 30.7,9.77 31.37,9.77 32.36,10.76 33.68,10.76 34.6,11.67 | 9.23,7.38 9.23,6.91 7.72,5.41 7.72,4.45 8.29,3.88 8.29,2.97 9.49,1.78 U4.8 11.51,0.89 20.57,0.89 22.22,2.54 22.22,4.66 22.07,4.8 20.86,4.8 20.71,4.66 20.71,4.52 L1.C 19.99,5.45 L2.C v19.06,4.66 | D2.A 20.64,30.55 20.57,30.61 14.71,30.61 14.03,29.93 14.03,28.31 14.13,28.21
  Top 0.203: U1.42 14.42,27.92 14.13,28.21 | U1.1 13.83,27.92 14.13,28.21 | C1.2 20.22,12.34 19.94,12.07 17.4,12.07 17.26,11.92 | 17.26,11.92 17.26,10.61 17.4,10.46 17.68,10.46 18.01,10.13 C8.2 | U1.25 15.69,13.49 15.74,13.44 16.09,13.44 16.46,13.06 16.46,12.71 17.26,11.92 | 20.18,9.53 21.06,8.65 v21.06,8.44 | v25.29,7.39 25.32,7.35 25.93,7.35 | U2.16 22.56,23.01 U2.EXP@15 22.31,21.74 22.34,21.71 | U2.PWR@2 22.81,20.21 U2.EXP@3 | U2.EXP@14 23.31,22.64 22.81,22.14 U2.PWR@2 | 22.34,21.71 U2.EXP@11 U2.EXP@12 | U2.PWR@2 22.34,20.76 U2.EXP@7 U2.EXP@8 | U2.PWR@2 22.34,21.71 | U2.PWR@2 23.13,21.24 24.49,22.6 | U2.PWR@2 22.84,21.24 24.35,22.75
  Bottom 0.203: U2.PWR@2 22.79,21.24 U2.EXP@7 | 22.34,21.71 21.78,21.71 | 21.78,21.71 U2.EXP@12 | 22.84,21.24 22.96,21.36 | 22.96,21.36 U2.EXP@10 | U2.EXP@14 22.81,22.26 U2.PWR@2 | U2.PWR@2 22.94,21.36 22.96,21.36 | 22.34,21.71 22.31,21.74 U2.EXP@15 | U2.PWR@2 22.84,21.24 | 22.84,21.24 23.15,20.92 | 23.15,20.92 U2.EXP@6 | U2.PWR@2 23.13,20.92 23.15,20.92 | U2.PWR@2 22.34,21.71 | U2.PWR@2 23.31,20.74 U2.EXP@2 | U2.PWR@2 U2.EXP@4 | U2.PWR@2 22.34,20.76 U2.EXP@8 | U2.PWR@2 22.26,21.24 21.78,21.71 | v26.38,17.42 26.38,8.48 v25.29,7.39 | v19.06,4.66 19.72,4.66 21.45,6.39 21.45,6.89 21.47,6.91 21.47,7.43 21.06,7.84 v21.06,8.44
  pour Top (isolate 0.305): 0,0 36.58,0 36.58,30.99 0,30.99
  pour Bottom (isolate 0.305): 0,0 36.58,0 36.58,30.99 0,30.99
INN  (via drill 0.25 pad 0.25)
  Top 0.203: v34.7,22.86 34.7,19.9 v34.73,19.86 | J1.4 29.22,15.6 29,15.82 28.73,15.82 28.03,16.52 28.03,16.79 27.88,16.94 27.65,17.17 | U2.1 27.65,17.17 | J1.9 27.65,25.6 27.65,17.17
  Bottom 0.203: J1.9 30.54,25.86 30.54,23.17 30.69,23.02 31.35,23.02 X1.12 31.51,22.86 v34.7,22.86 | v34.73,19.86 31.51,19.86 X1.18
INP  (via drill 0.25 pad 0.25)
  Top 0.203: U2.2 26.26,19.49 26.92,20.16 26.92,20.74 v27.01,20.83 | v14.07,3.4 13.16,4.32 U4.4
  Bottom 0.203: v27.01,20.83 23.98,17.79 22.23,17.79 21.86,17.42 21.86,16.89 24.64,14.11 24.64,2.95 24.62,2.93 19.3,2.93 19.07,3.16 18.55,3.16 18.32,2.93 14.54,2.93 v14.07,3.4
LED2
  Top 0.203: U1.26 17.58,15.62 R2.2
N$1
  Top 0.203: L1.A 21.28,2.3 21.37,2.21 21.47,2.3 R1.1
N$4  (via drill 0.25 pad 0.25)
  Top 0.203: R2.1 18.28,13.58 v19.11,12.74 | v18.28,7.07 18.32,7.02 L2.A
  Bottom 0.203: v18.28,7.07 19.11,7.91 v19.11,12.74
NIR1-  (via drill 0.25 pad 0.25)
  Top 0.203: v33.29,18.94 33.29,22.77 31.42,24.64 J1.8 | U4.11 17.04,3.05 v17.87,3.87
  Bottom 0.203: X1.20 33.28,18.93 v33.29,18.94 | v17.87,3.87 18.02,4.03 21.32,4.03 24.27,6.98 24.27,8.61 24.18,8.7 24.18,14.07 21.5,16.75 21.5,16.85 20.23,18.12 20.23,24.57 25.14,24.57 25.51,24.2 28.79,24.2 J1.8
NIR2-  (via drill 0.25 pad 0.25)
  Top 0.203: U4.10 18.69,2.41 v18.81,2.53 | v27.51,3.44 29.16,3.44 v30.47,4.75
  Bottom 0.203: v18.81,2.53 22.32,2.53 22.44,2.41 26.47,2.41 v27.51,3.44 | v30.47,4.75 30.47,5.42 31.13,6.08 31.13,10.03 J1.3 27.52,11.94 26.91,12.55 26.91,16.9 27.03,17.01 27.03,18.13 26.87,18.28 26.87,19.58 27.95,20.65 27.95,22.75 28.49,23.29 29.72,23.29 30.42,22.59 30.42,21.93 X1.14
OPD1-  (via drill 0.25 pad 0.25)
  Top 0.203: U4.2 10.57,5.64 9.31,5.64 9.25,5.58 v8.79,5.58 | J1.10 34.56,29.72 35.64,28.64 35.64,17.48 35.39,17.23 33.87,17.23 v33.76,17.12
  Bottom 0.203: v33.76,17.12 33.56,16.93 X1.24 | J1.10 28.94,30 17.56,30 17.12,29.55 17.12,29.43 16.32,28.63 11.53,28.63 11.16,28.26 11.16,20.61 10.59,20.61 5.37,25.83 2.44,25.83 1.74,25.13 1.74,24.14 2.44,23.44 4.94,23.44 8.1,20.29 8.1,7.83 8.79,7.14 v8.79,5.58
OPD2-  (via drill 0.25 pad 0.25)
  Top 0.203: U4.3 v12.22,4.95 | v31.23,11.72 31.62,12.12 31.62,12.17 32.79,13.34 33.6,13.34 v33.96,13.69
  Bottom 0.203: J1.5 30.47,15.77 30.47,14.22 30.8,13.89 31.41,13.89 X1.30 31.54,13.83 32.2,13.83 32.47,13.56 33.37,13.56 33.5,13.69 v33.96,13.69 | v12.22,4.95 9.42,4.95 9.09,4.62 9.35,4.37 9.28,4.37 9.19,4.46 8.44,4.46 6.9,5.99 6.45,5.99 5.48,5.03 5.48,4.09 8.99,0.58 9.26,0.58 9.35,0.49 28.32,0.49 31.84,4.01 31.84,11.11 v31.23,11.72
RED1-  (via drill 0.25 pad 0.25)
  Top 0.203: U4.5 9.07,3.68 v8.93,3.82
  Bottom 0.203: v8.93,3.82 8.57,3.82 6.76,5.64 6.46,5.34 6.29,5.34 5.84,4.88 5.84,4.24 9.13,0.94 28.27,0.94 31.48,4.16 31.48,10.18 30.43,11.24 30.43,12.64 29.93,13.13 28.73,13.13 28.72,13.12 27.65,13.12 27.27,13.5 27.27,16.75 28.73,18.21 | 28.73,18.21 29.72,18.21 30,17.93 X1.22 | 28.73,18.21 27.45,18.21 27.23,18.43 27.23,19.43 29.22,21.43 J1.7
RED2-  (via drill 0.25 pad 0.25)
  Top 0.203: v13.82,2.46 13.23,3.05 U4.6 | v33.11,14.2 32.04,13.13 28.73,13.13 28.03,12.43 28.03,11.21 v27.56,10.74
  Bottom 0.203: v13.82,2.46 14.39,1.89 27.8,1.89 28.36,2.45 28.36,6.03 28.03,6.36 28.03,8.2 J1.2 28.9,9.4 v27.56,10.74 | X1.28 31.54,14.83 32.2,14.83 32.83,14.2 v33.11,14.2
SPI_SCLK
  Top 0.203: U2.24 18.41,21.99 17.88,21.46 17.88,20.88 16.53,20.88 U1.32
SPI_SIMO
  Top 0.203: U2.26 18.61,20.99 18.59,20.97 18.59,20.58 17.64,19.63 17.64,19.58 17.51,19.46 17.21,19.46 17.15,19.52 U1.30
SPI_SOMI
  Top 0.203: U2.25 18.41,21.49 18.24,21.32 18.24,20.73 18.03,20.52 17.92,20.52 17.61,20.22 U1.31
SPI_STE
  Top 0.203: U2.27 19.68,20.38 18.89,20.38 18,19.48 18,19.44 17.66,19.1 17.61,19.1 17.27,18.76 17.08,18.76 17.02,18.82 U1.29
SWCLK
  Top 0.203: J2.5 3.64,26.47 11.76,26.47 14.49,23.74 14.49,23.66 16.43,23.66 U1.36
SWDIO  (via drill 0.25 pad 0.25)
  Top 0.203: J2.4 10.05,24.64 | 10.05,24.64 12.93,24.64 14.55,23.02 U1.35 | v23.57,7.18 23.58,7.16 R3.1 | v9.84,25.59 10.05,25.39 10.05,24.64 | v9.7,28.85 12.45,28.85 14.56,30.96 26.48,30.96 27.8,29.64 27.8,28.37 29.72,28.37 30.42,27.67 30.42,26.68 29.72,25.98 28.53,25.98 28,25.46 28,18.21 31.57,18.21 33.74,16.04 33.74,14.97 33.97,14.74 33.99,14.74 34.59,14.13 34.59,13.43 34.22,13.06 34.04,13.06 RESET.4
  Bottom 0.203: J2.4 6.06,24.64 10.85,19.85 10.85,19.71 11.5,19.06 13.77,19.06 15.19,17.65 15.19,12.54 15.56,12.17 16.09,12.17 16.64,12.72 16.64,25.54 19.93,28.83 23.86,28.83 24.26,28.43 24.26,27.91 23.89,27.53 22.42,27.53 19.83,24.95 19.83,10.86 23.57,7.12 v23.57,7.18 | v9.7,28.85 9.7,25.73 v9.84,25.59
TX_REF
  Top 0.203: U2.9 25.94,23.09 26.33,23.09 26.58,23.34 26.58,24.93 25.32,26.19 C6.1
TXN  (via drill 0.25 pad 0.25)
  Top 0.203: U2.14 23.45,24.37 23.45,26.35 22.8,27.01 | 22.8,27.01 D1.C | v14.22,4.61 15,3.84 15,2.08 15.14,1.93 15.84,1.93 U4.9 | v23.62,28.17 23.62,27.84 22.8,27.01
  Bottom 0.203: v14.22,4.61 14.22,9.16 17.35,12.29 17.35,25.06 18.14,25.84 20.23,25.84 22.55,28.17 v23.62,28.17
TXP  (via drill 0.25 pad 0.25)
  Top 0.203: 20.77,27.06 21.29,27.06 22,26.34 22.82,26.34 23.06,26.1 U2.15 | 20.77,27.06 D2.C | U4.7 v12.51,2.41 | v21.68,28.19 20.77,27.28 20.77,27.06
  Bottom 0.203: v12.51,2.41 13.37,3.28 13.37,10.43 14.57,11.62 16.18,11.62 16.99,12.43 16.99,25.39 17.8,26.2 19.69,26.2 v21.68,28.19
VBAT  (via drill 0.25 pad 0.25)
  Top 0.203: S1.1 7.62,3.58 v7.66,3.62 | 33.29,8.19 32.14,8.19 U5.5 30.63,8.26 J1.1 | 33.29,8.19 33.4,8.08 33.4,7.39 33.48,7.31 U5.1 34.32,6.87 C9.1 | 33.29,8.19 34.31,9.21 U5.3 34.2,9.21 33.01,10.4 32.63,10.02 v32.52,10.02
  Bottom 0.203: v7.66,3.62 9.98,1.29 28.12,1.29 29.22,2.4 J1.1 | X1.10 31.47,23.9 35.18,23.9 35.57,23.51 35.57,20.92 | 35.57,15.99 35.57,13.07 35.43,12.93 X1.32 32.98,11.39 32.98,10.34 32.79,10.34 32.52,10.07 v32.52,10.02 | 35.57,15.99 35.57,20.92 | 35.57,20.92 35.56,20.93 X1.16 30.59,20.93 J1.6 | 35.57,15.99 35.51,15.93 33.74,15.93 X1.26
VBAT+  (via drill 0.25)
  Top 0.203: v1.32,4.06 2.23,3.15 3.57,3.15 4.98,1.73 S1.2
  Bottom 0.203: J2.1 1.37,15.46 1.37,4.12 v1.32,4.06
VBAT-
  Top 0.203: J2.2 0.69,17.31 0.69,9.58 2.05,8.21 3.22,8.21 4.05,7.38 S1.5
XIN
  Top 0.203: U2.38 24.04,18.19 24.04,16.99 24.18,16.99 24.6,16.57 24.6,16.56 Q1.P$1 26.17,11.59 C3.1
XOUT
  Top 0.203: U2.37 23.56,16.19 Q1.P$2 22.83,14.53 24.22,14.53 24.44,14.31 C4.1

### Text on the board
tPlace: ppg_v1 '18/08/07 | OPD1- | CLK | 3V | OPD1+ | DIO | NIR1- | GND | RED1- | BAT- | OLED+ | OPD2- | BAT+ | R2 | OPD2+ | Q1 | 1K | N2- | R2- | R3 | 10K | OLED+